# Altium project IOT NODE.PrjPcb
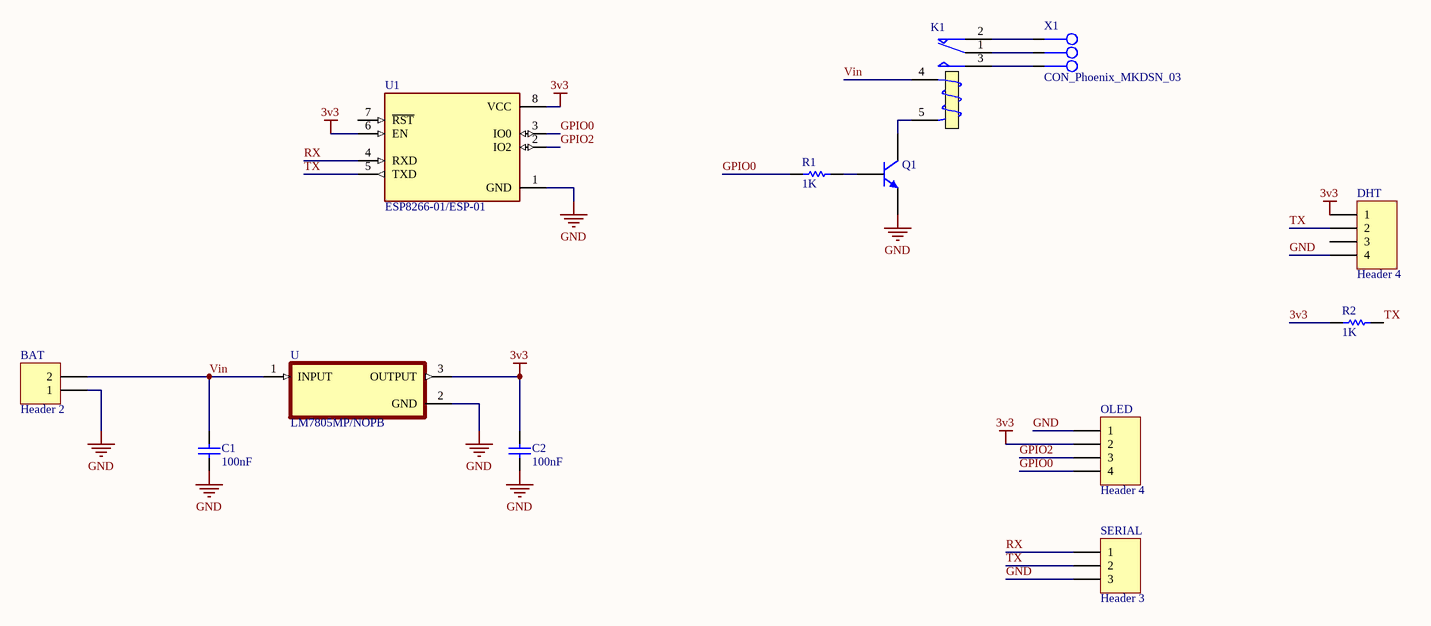
[diagram p0: Sheet ionode.SchDoc]
1 sheet, 13 parts. Net scope: global (net labels, ports and power ports of the same name join across sheets).
Board file: PCB ionode.PcbDoc

## Sheet Sheet ionode.SchDoc
size B; Organization: Altium Limited; Address1: L3, 12a Rodborough Rd; Address2: Frenchs Forest; Address3: NSW; Address4: Australia 2086

### Parts
BAT  Header 2  [HDR1X2]
C1  100nF  [CAP1206]
C2  100nF  [CAP1206]
DHT  Header 4  [HDR1X4]
K1  (no value)  [Relay 18.85x15.35x15.70]
OLED  Header 4  [HDR1X4]
Q1  (no value)  [SOT23_N]
R1  1K  [RESC4817X04N]
R2  1K  [RESC4817X04N]
SERIAL  Header 3  [HDR1X3]
U  LM7805MP/NOPB  [SOT230P700X180-4N]
U1  ESP8266-01/ESP-01  [XCVR_ESP8266-01/ESP-01]
X1  CON_Phoenix_MKDSN_03  [CON_MKDSN1,5/3-5,08]

### Nets
3v3: C2.2 DHT.1 OLED.2 R2.1 U.3(OUTPUT) U1.6(EN) U1.8(VCC)
GND: BAT.1 C1.1 C2.1 DHT.4 OLED.1 Q1.3(C) SERIAL.3 U.2(GND) U1.1(GND)
GPIO0: OLED.4 R1.1 U1.3(IO0)
GPIO2: OLED.3 U1.2(IO2)
RX: SERIAL.1 U1.4(RXD)
TX: DHT.2 R2.2 SERIAL.2 U1.5(TXD)
Vin: BAT.2 C1.2 K1.4(T1) U.1(INPUT)
NetK1_1: K1.1(COM) X1.2
NetK1_2: K1.2(NC) X1.1
NetK1_3: K1.3(NO) X1.3
NetK1_5: K1.5(T2) Q1.2(B)
NetQ1_1: Q1.1(E) R1.2

Not connected (* = marked no-connect by the designer): DHT 3; U1 7(~{RST})

### Notes on the sheet
- Title
- Size:
- Date:
- B
- Number:
- Time:
- Revision:
- Sheet
- of
- File:

### Library data of the parts
BAT = Header 2: Header, 2-Pin; LatestRevisionDate: 17-Jul-2002; LatestRevisionNote: Re-released for DXP Platform.; Publisher: Altium Limited
C1 C2 = CAP SMD PACKAGE: TOTAL CAPACITOR SMD PACK; Designer: Abbas Basereh; Desc.: CAP SMD TOTAL PACKAGES; Data: 2017-3-10; VALUE: 100nF
DHT OLED = Header 4: Header, 4-Pin; LatestRevisionDate: 17-Jul-2002; LatestRevisionNote: Re-released for DXP Platform.; Publisher: Altium Limited
K1 = RELAY_SPDT: Single-Pole Dual-Throw Relay; Designer: Abbas Basereh; Mounting Technology: Through-Hole; ComponentLink1Description: Datasheet; Pin Count: 0; Update Date: 2017-3-1
Q1 = 2N3904: NPN General Purpose Amplifier; Published: 8-Jun-2000; LatestRevisionDate: 15-Jan-2003; LatestRevisionNote: PCB Footprint 'BCY-W3/D4.7' replaced; DatasheetVersion: 1997; PackageVersion: Sep-1998; PackageReference: TO-92A; Publisher: Altium Limited; PackageDescription: TO, Flat Index; 3 In-Line, Axial Leads; Body Dia. 4.5mm; Leads 0.51 x 0.48 mm (max); ComponentLink1Description: Manufacturer Link; ComponentLink1URL: http://www.fairchildsemi.com/; ComponentLink2Description: Datasheet; ComponentLink2URL: http://www.fairchildsemi.com/ds/2N%2F2N3904.pdf
R1 R2 = RES 1206 0.25W: RES 1206; Designer: Abbas Basereh; Desc.: RES SMD 1206; Data: 16-12-2016
SERIAL = Header 3: Header, 3-Pin; LatestRevisionDate: 17-Jul-2002; LatestRevisionNote: Re-released for DXP Platform.; Publisher: Altium Limited
U = LM7805MP/NOPB: 1.5-A, Wide VIN Fixed Voltage Regulators; MF: Texas Instruments; MP: LM7805MP/NOPB; Price: None; Package: SOT-223-4 Texas Instruments; Texas_Instruments-Purchase-URL: https://snapeda.com/shop?store=Texas+Instruments&id=545076; Value: *; Availability: Unavailable; SnapEDA_Link: https://www.snapeda.com/parts/LM7805MP/NOPB/Texas%20Instruments/view-part/545076/?ref=snap
U1 = ESP8266-01/ESP-01: MakerFocus 4pcs ESP8266 ESP-01 Serial Wireless WiFi Transceiver Receiver Module 1MB SPI Flash DC3.0-3.6V Internet of Things WiFi Module Board Compatible with Ar duino; MF: AI-Thinker; SnapEDA_Link: https://www.snapeda.com/parts/ESP8266-01/ESP-01/AI-Thinker/view-part/?ref=snap; Availability: Not in stock; Price: None; Package: Non-Standard AI-Thinker; Check_prices: https://www.snapeda.com/parts/ESP8266-01/ESP-01/AI-Thinker/view-part/?ref=eda; Value: *; MP: ESP8266-01/ESP-01
X1 = CON_Phoenix_MKDSN_03: Manufacturer: PHOENIX CONTACT; Company: SJ Libraries; Connector type: PCB Terminal Block; designer: Eng. Saeid Jorablo; Max Current: 13.5 A; Positions: 3; Revision 1: 2012/10/1 : Adding Model; Voltage: 400 V; Category: Connector; ComponentLink1Description: Datasheet; ComponentLink2Description: Reference; HelpURL: http://s3.picofile.com/file/7443264187/Coming_Soon_logo.gif; Mounting Technology: Through-Hole; Pin Count: 3; Publisher: SJ UnLimited; Status: Unreleased; Update: 2012/10/1